# Altium schematic sheet Peripheral.SchDoc: Peripherals
size A4; Organization: Thomas More: Embedded IT; Address1: Robbe Van Assche; Address2: Belgium; Address3: 2013; Address4: Proof Of Concept: An Analog Datalogger; DocumentNumber: ALT0061; Revision: A; SheetNumber: 2; SheetTotal: 4
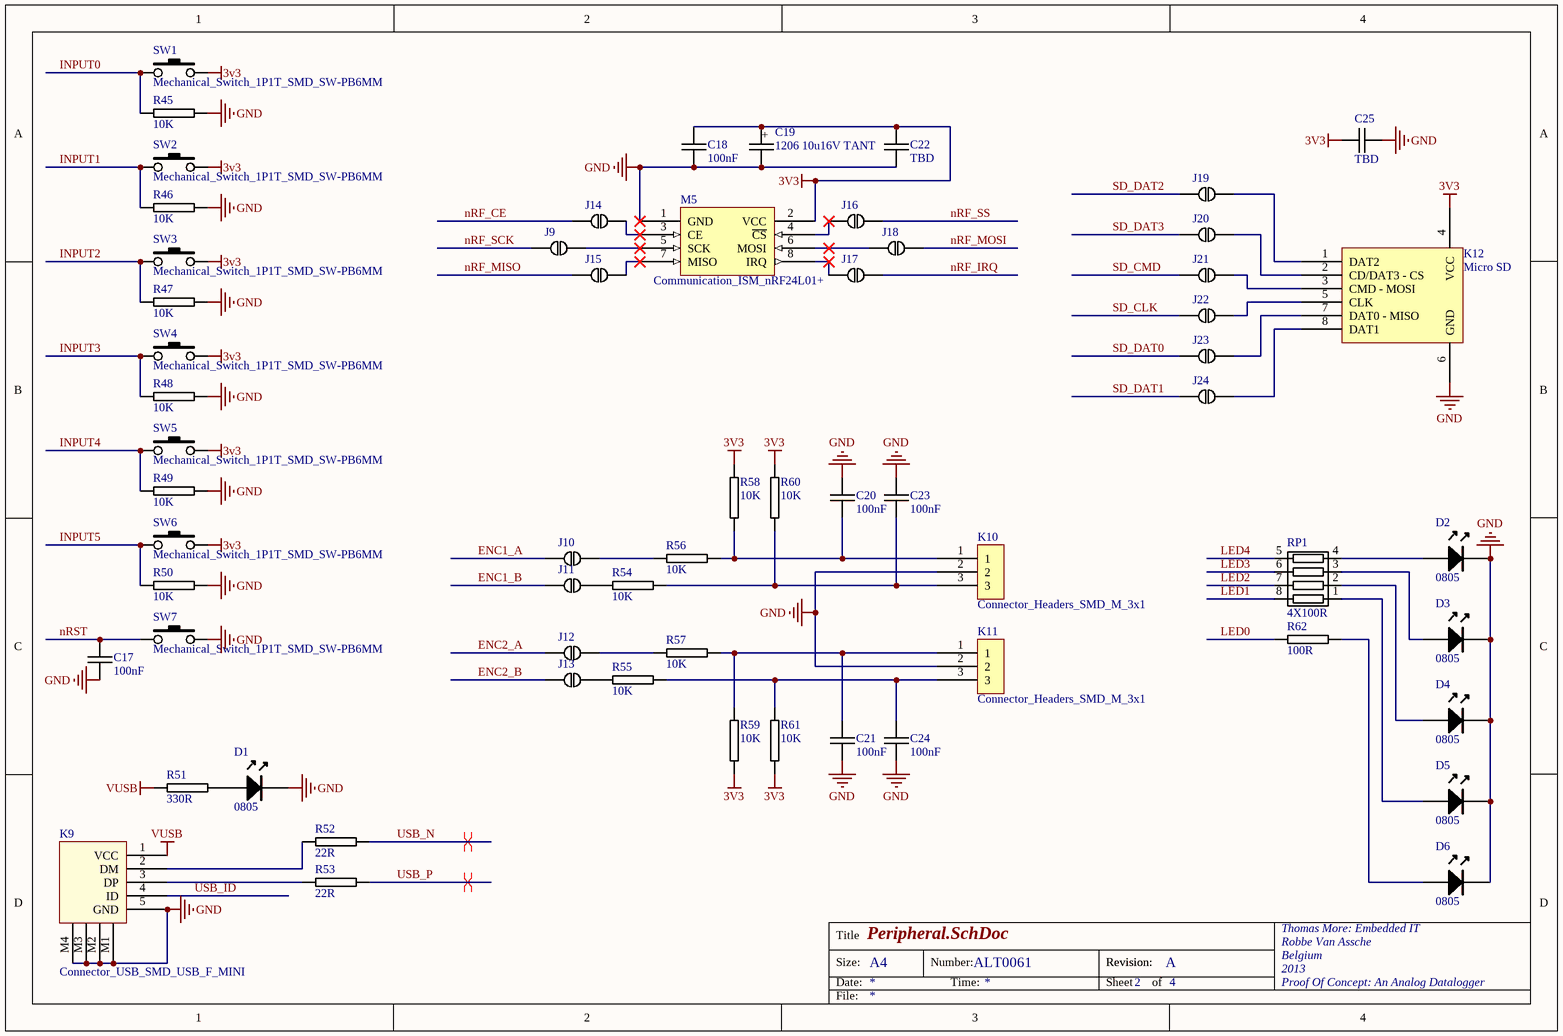
[diagram p0: Peripheral.SchDoc]

## Parts
C17  100nF  [0603C-GENERIC]
C18  100nF  [0603C-GENERIC]
C19  1206 10u16V TANT  [1206C+_TANTAL-10u16V]
C20  100nF  [0603C-GENERIC]
C21  100nF  [0603C-GENERIC]
C22  TBD  [1210C-GENERIC]
C23  100nF  [0603C-GENERIC]
C24  100nF  [0603C-GENERIC]
C25  TBD  [1210C-GENERIC]
D1  0805  [0805LED]
D2  0805  [0805LED]
D3  0805  [0805LED]
D4  0805  [0805LED]
D5  0805  [0805LED]
D6  0805  [0805LED]
J9  Connector_Production Connectors_SMD_BYPASS  [BYPASS]  (value not drawn)
J10  Connector_Production Connectors_SMD_BYPASS  [BYPASS]  (value not drawn)
J11  Connector_Production Connectors_SMD_BYPASS  [BYPASS]  (value not drawn)
J12  Connector_Production Connectors_SMD_BYPASS  [BYPASS]  (value not drawn)
J13  Connector_Production Connectors_SMD_BYPASS  [BYPASS]  (value not drawn)
J14  Connector_Production Connectors_SMD_BYPASS  [BYPASS]  (value not drawn)
J15  Connector_Production Connectors_SMD_BYPASS  [BYPASS]  (value not drawn)
J16  Connector_Production Connectors_SMD_BYPASS  [BYPASS]  (value not drawn)
J17  Connector_Production Connectors_SMD_BYPASS  [BYPASS]  (value not drawn)
J18  Connector_Production Connectors_SMD_BYPASS  [BYPASS]  (value not drawn)
J19  Connector_Production Connectors_SMD_BYPASS  [BYPASS]  (value not drawn)
J20  Connector_Production Connectors_SMD_BYPASS  [BYPASS]  (value not drawn)
J21  Connector_Production Connectors_SMD_BYPASS  [BYPASS]  (value not drawn)
J22  Connector_Production Connectors_SMD_BYPASS  [BYPASS]  (value not drawn)
J23  Connector_Production Connectors_SMD_BYPASS  [BYPASS]  (value not drawn)
J24  Connector_Production Connectors_SMD_BYPASS  [BYPASS]  (value not drawn)
K9  Connector_USB_SMD_USB_F_MINI  [USB_F_MINI]
K10  Connector_Headers_SMD_M_3x1  [Header_Male_2.54 3x1]
K11  Connector_Headers_SMD_M_3x1  [Header_Male_2.54 3x1]
K12  Micro SD  [SCHD3A0100]
M5  Communication_ISM_nRF24L01+  [nRF24L01+_SMD]
R45  10K  [0805R-10K]
R46  10K  [0805R-10K]
R47  10K  [0805R-10K]
R48  10K  [0805R-10K]
R49  10K  [0805R-10K]
R50  10K  [0805R-10K]
R51  330R  [0805R-330]
R52  22R  [0805R-22]
R53  22R  [0805R-22]
R54  10K  [0603R-TBD]
R55  10K  [0603R-TBD]
R56  10K  [0603R-TBD]
R57  10K  [0603R-TBD]
R58  10K  [0603R-TBD]
R59  10K  [0603R-TBD]
R60  10K  [0603R-TBD]
R61  10K  [0603R-TBD]
R62  100R  [0603R-100]
RP1  4X100R  [1206-ARRAY-4-GENERIC]
SW1  Mechanical_Switch_1P1T_SMD_SW-PB6MM  [SW-PB-SMD]
SW2  Mechanical_Switch_1P1T_SMD_SW-PB6MM  [SW-PB-SMD]
SW3  Mechanical_Switch_1P1T_SMD_SW-PB6MM  [SW-PB-SMD]
SW4  Mechanical_Switch_1P1T_SMD_SW-PB6MM  [SW-PB-SMD]
SW5  Mechanical_Switch_1P1T_SMD_SW-PB6MM  [SW-PB-SMD]
SW6  Mechanical_Switch_1P1T_SMD_SW-PB6MM  [SW-PB-SMD]
SW7  Mechanical_Switch_1P1T_SMD_SW-PB6MM  [SW-PB-SMD]

## Nets
3v3: C18.2 C19.1 C22.1 C25.1 K12.4(VCC) M5.2(VCC) R58.1 R59.1 R60.1 R61.1 SW1.2 SW2.2 SW3.2 SW4.2 SW5.2 SW6.2
GND: C17.1 C18.1 C19.2 C20.1 C21.1 C22.2 C23.1 C24.1 C25.2 D1.K D2.K D3.K D4.K D5.K D6.K K9.5(GND) K9.M1 K9.M2 K9.M3 K9.M4 K10.2 K11.2 K12.6(GND) M5.1(GND) R45.2 R46.2 R47.2 R48.2 R49.2 R50.2 SW7.2
VUSB: K9.1(VCC) R51.1
ENC1_A: J10.1
ENC1_B: J11.1
ENC2_A: J12.1
ENC2_B: J13.1
INPUT0: R45.1 SW1.1
INPUT1: R46.1 SW2.1
INPUT2: R47.1 SW3.1
INPUT3: R48.1 SW4.1
INPUT4: R49.1 SW5.1
INPUT5: R50.1 SW6.1
LED0: R62.1
LED1: RP1.8
LED2: RP1.7
LED3: RP1.6
LED4: RP1.5
nRF_CE: J14.1
nRF_IRQ: J17.2
nRF_MISO: J15.1
nRF_MOSI: J18.2
nRF_SCK: J9.1
nRF_SS: J16.2
nRST: C17.2 SW7.1
SD_CLK: J22.1
SD_CMD: J21.1
SD_DAT0: J23.1
SD_DAT1: J24.1
SD_DAT2: J19.1
SD_DAT3: J20.1
USB_ID: K9.4(ID)
USB_N: R52.2
USB_P: R53.2
NetC20_2: C20.2 K10.1 R56.2 R58.2
NetC21_2: C21.2 K11.1 R57.2 R59.2
NetC23_2: C23.2 K10.3 R54.2 R60.2
NetC24_2: C24.2 K11.3 R55.2 R61.2
NetD1_A: D1.A R51.2
NetD2_A: D2.A RP1.4
NetD3_A: D3.A RP1.3
NetD4_A: D4.A RP1.2
NetD5_A: D5.A RP1.1
NetD6_A: D6.A R62.2
NetJ9_2: J9.2 M5.5(SCK)
NetJ10_2: J10.2 R56.1
NetJ11_2: J11.2 R54.1
NetJ12_2: J12.2 R57.1
NetJ13_2: J13.2 R55.1
NetJ14_2: J14.2 M5.3(CE)
NetJ15_2: J15.2 M5.7(MISO)
NetJ16_1: J16.1 M5.4(~{CS})
NetJ17_1: J17.1 M5.8(IRQ)
NetJ18_1: J18.1 M5.6(MOSI)
NetJ19_2: J19.2 K12.1(DAT2)
NetJ20_2: J20.2 K12.2(CD/DAT3_-_CS)
NetJ21_2: J21.2 K12.3(CMD_-_MOSI)
NetJ22_2: J22.2 K12.5(CLK)
NetJ23_2: J23.2 K12.7(DAT0_-_MISO)
NetJ24_2: J24.2 K12.8(DAT1)
NetK9_2: K9.2(DM) R52.1
NetK9_3: K9.3(DP) R53.1

## Layout directives
differential pair: USB_N, USB_P

## Notes on the sheet
- Title
- Size:
- Date:
- A4
- Number:
- Time:
- Revision:
- Sheet
- of
- File:
- (in symbol Passives_Capacitors_Tantalum_1206C-TANTAL SIZE A-10u16V) +

## Library data of the parts
C17 C18 C20 C21 C23 C24 = Passives_Capacitors_0603_100NF-25V-X7R-TDK: CAPACITOR 0603 CERAMIC; Manufacturer Part Number: C1608X7R1E104K; Manufacturer: TDK Corporation; Reel: C12; Supplier 1: Digi-Key; Supplier Part Number 1: 445-1316-2-ND
C19 = Passives_Capacitors_Tantalum_1206C-TANTAL SIZE A-10u16V
C22 C25 = Passives_Capacitors_1210_1210C-TBD: CAPACITOR 1210 CERAMIC VALUE TO BE DETERMINED
D1-D6 = LED_SMD_0805
J9-J24 = Connector_Production Connectors_SMD_BYPASS: SOLDERDOT BYPASS; Manufacturer Part Number 1: Board Feature; Reel: Open; Supplier 1: Solder-it-yourself; Manufacturer 1: Board feature
K9 = Connector_USB_SMD_USB_F_MINI: MINI USB B FEMALE
K10 K11 = Connector_Headers_SMD_M_3x1: SMD Header 3x1
K12 = Connector_SD_SMD_SCHD3A0100
M5 = Communication_ISM_nRF24L01+: nRF24L01+
R45-R50 = 0805R-10K: RESISTOR 0805 1/4 WATT THIN FILM; Reel: *
R51 = 0805R-330: RESISTOR 0805 1/4 WATT THIN FILM; Reel: *
R52 R53 = 0805R-22: RESISTOR 0805 1/4 WATT THIN FILM; Reel: *
R54-R61 = Passives_Resistors_0603_TBD: RESISTOR 0603 VALUE TO BE DETERMINED
R62 = 0603R-100: GENERIC RESISTOR 0603; Manufacturer Part Number: RMCF 1/16 100 1% R; Manufacturer: Stackpole Electronics Inc; Reel: R24; Supplier 1: Digi-Key; Supplier Part Number 1: RMCF1/16100FRDKR-ND
RP1 = ARRAY4-220R-ROHM: GENERIC RESISTOR ARRAY 4X INDEPENDENT; Manufacturer: Rohm Semiconductor; Manufacturer Part Number: MNR14E0APJ221; Number of Resistors: 4; Resistance In Ohms: 220; Circuit Type: Isolated; Power Per Element: 62.5mW; Tolerance: ±5%; Temperature Coefficient: ±200ppm/°C; Reel: RA3; Supplier 1: Digi-Key; Category: Resistors; Supplier: Digi-Key; Number of Pins: 8; Packaging: Tape & Reel (TR); RoHS: RoHS Compliant; Mounting Type: Surface Mount; Package / Case: 0603 x 4 Convex (1608 metric); Supplier Part Number 1: MNR14221RTR-ND; Supplier Part Number: MNR14221RTR-ND
SW1-SW7 = Mechanical_Switch_1P1T_SMD_SW-PB6MM: PUSHBUTTON SWITCH 6MM SMD